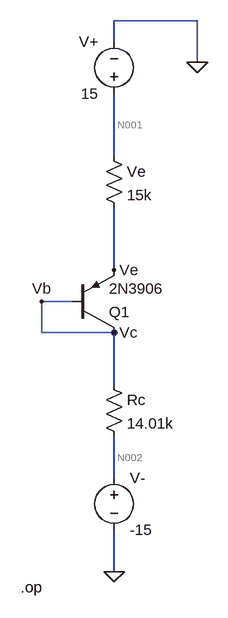
[diagram p0: schematic part3.asc]
part3.asc, the LTspice schematic file:
Version 4.1
SHEET 1 880 680
WIRE 368 -240 240 -240
WIRE 240 -208 240 -240
WIRE 368 -176 368 -240
WIRE 240 -32 240 -128
WIRE 240 144 240 48
WIRE 176 192 128 192
WIRE 128 240 128 192
WIRE 240 240 128 240
WIRE 240 320 240 240
WIRE 240 464 240 400
WIRE 240 608 240 544
FLAG 368 -176 0
FLAG 240 608 0
FLAG 240 144 Ve
FLAG 128 192 Vb
FLAG 240 240 Vc
SYMBOL pnp 176 240 M180
SYMATTR InstName Q1
SYMATTR Value 2N3906
SYMBOL res 224 -48 R0
SYMATTR InstName Ve
SYMATTR Value 15k
SYMBOL res 224 304 R0
SYMATTR InstName Rc
SYMATTR Value 14.01k
SYMBOL voltage 240 -112 R180
WINDOW 0 24 96 Left 2
WINDOW 3 24 16 Left 2
SYMATTR InstName V+
SYMATTR Value 15
SYMBOL voltage 240 448 R0
SYMATTR InstName V-
SYMATTR Value -15
TEXT 96 632 Left 2 !.op

The netlist it stands for:
* part3.asc
Q1 Vc Vc Ve 0 2N3906
R§Ve N001 Ve 15k
Rc Vc N002 14.01k
V+ N001 0 15
V- N002 0 -15
.model NPN NPN
.model PNP PNP
.lib standard.bjt
.op
.backanno
.end

* Results of the author's LTspice run, read from the files saved beside the schematic
* Operating Point:
*   V(ve) = -172.9 mV
*   V(n002) = -15 V
*   V(vc) = -828.5 mV
*   V(n001) = 15 V
*   Ic(Q1) = -1.006 mA
*   Ib(Q1) = -5.045 µA
*   Ie(Q1) = 1.012 mA
*   Is(Q1) = 0 A
*   I(Rc) = 1.012 mA
*   I(V-) = 1.012 mA
*   I(V+) = -1.012 mA
*   I(Ve) = 1.012 mA